# Altium schematic sheet IST8310.SchDoc
size A4
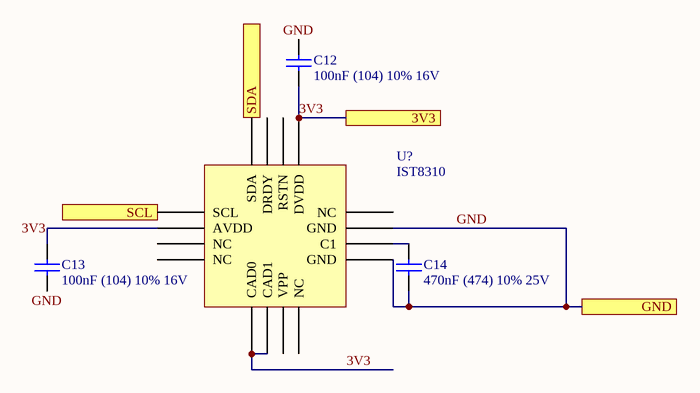
[diagram p0: IST8310.SchDoc]

## Parts
C12  100nF (104) 10% 16V  [0402_C]
C13  100nF (104) 10% 16V  [0402_C]
C14  470nF (474) 10% 25V  [0603_C]
U?  IST8310  [IST8310_LGA16]

## Ports
3V3, GND, SCL, SDA

## Nets
3V3: C12.1 C13.1 U?.2(AVDD) U?.5(CAD0) U?.6(CAD1) U?.13(DVDD) ; port 3V3
GND: C12.2 C13.2 C14.1 U?.9(GND) U?.11(GND) ; port GND
SCL: U?.1(SCL) ; port SCL
SDA: U?.16(SDA) ; port SDA
NetC14_2: C14.2 U?.10(C1)

Not connected (* = marked no-connect by the designer): U? 3(NC) 4(NC) 7(VPP) 8(NC) 12(NC) 14(RSTN) 15(DRDY)

## Library data of the parts
C12 C13 = 0402 100nF (104) 10% 16V: 贴片电容; ComponentLink1Description: 供应商链接; ComponentLink1URL: http://www.szlcsc.com/product/details_1877.html; Package: 0402; Supplier: LC; SuppliersPartNumber: C1525
C14 = 0603 470nF (474) 10% 25V: 贴片电容; ComponentLink1Description: 供应商链接; ComponentLink1URL: http://www.szlcsc.com/product/details_1975.html; Package: 0603; Supplier: LC; SuppliersPartNumber: C1623